# EAGLE schematic Pure SH (EAGLE 8.7.0)
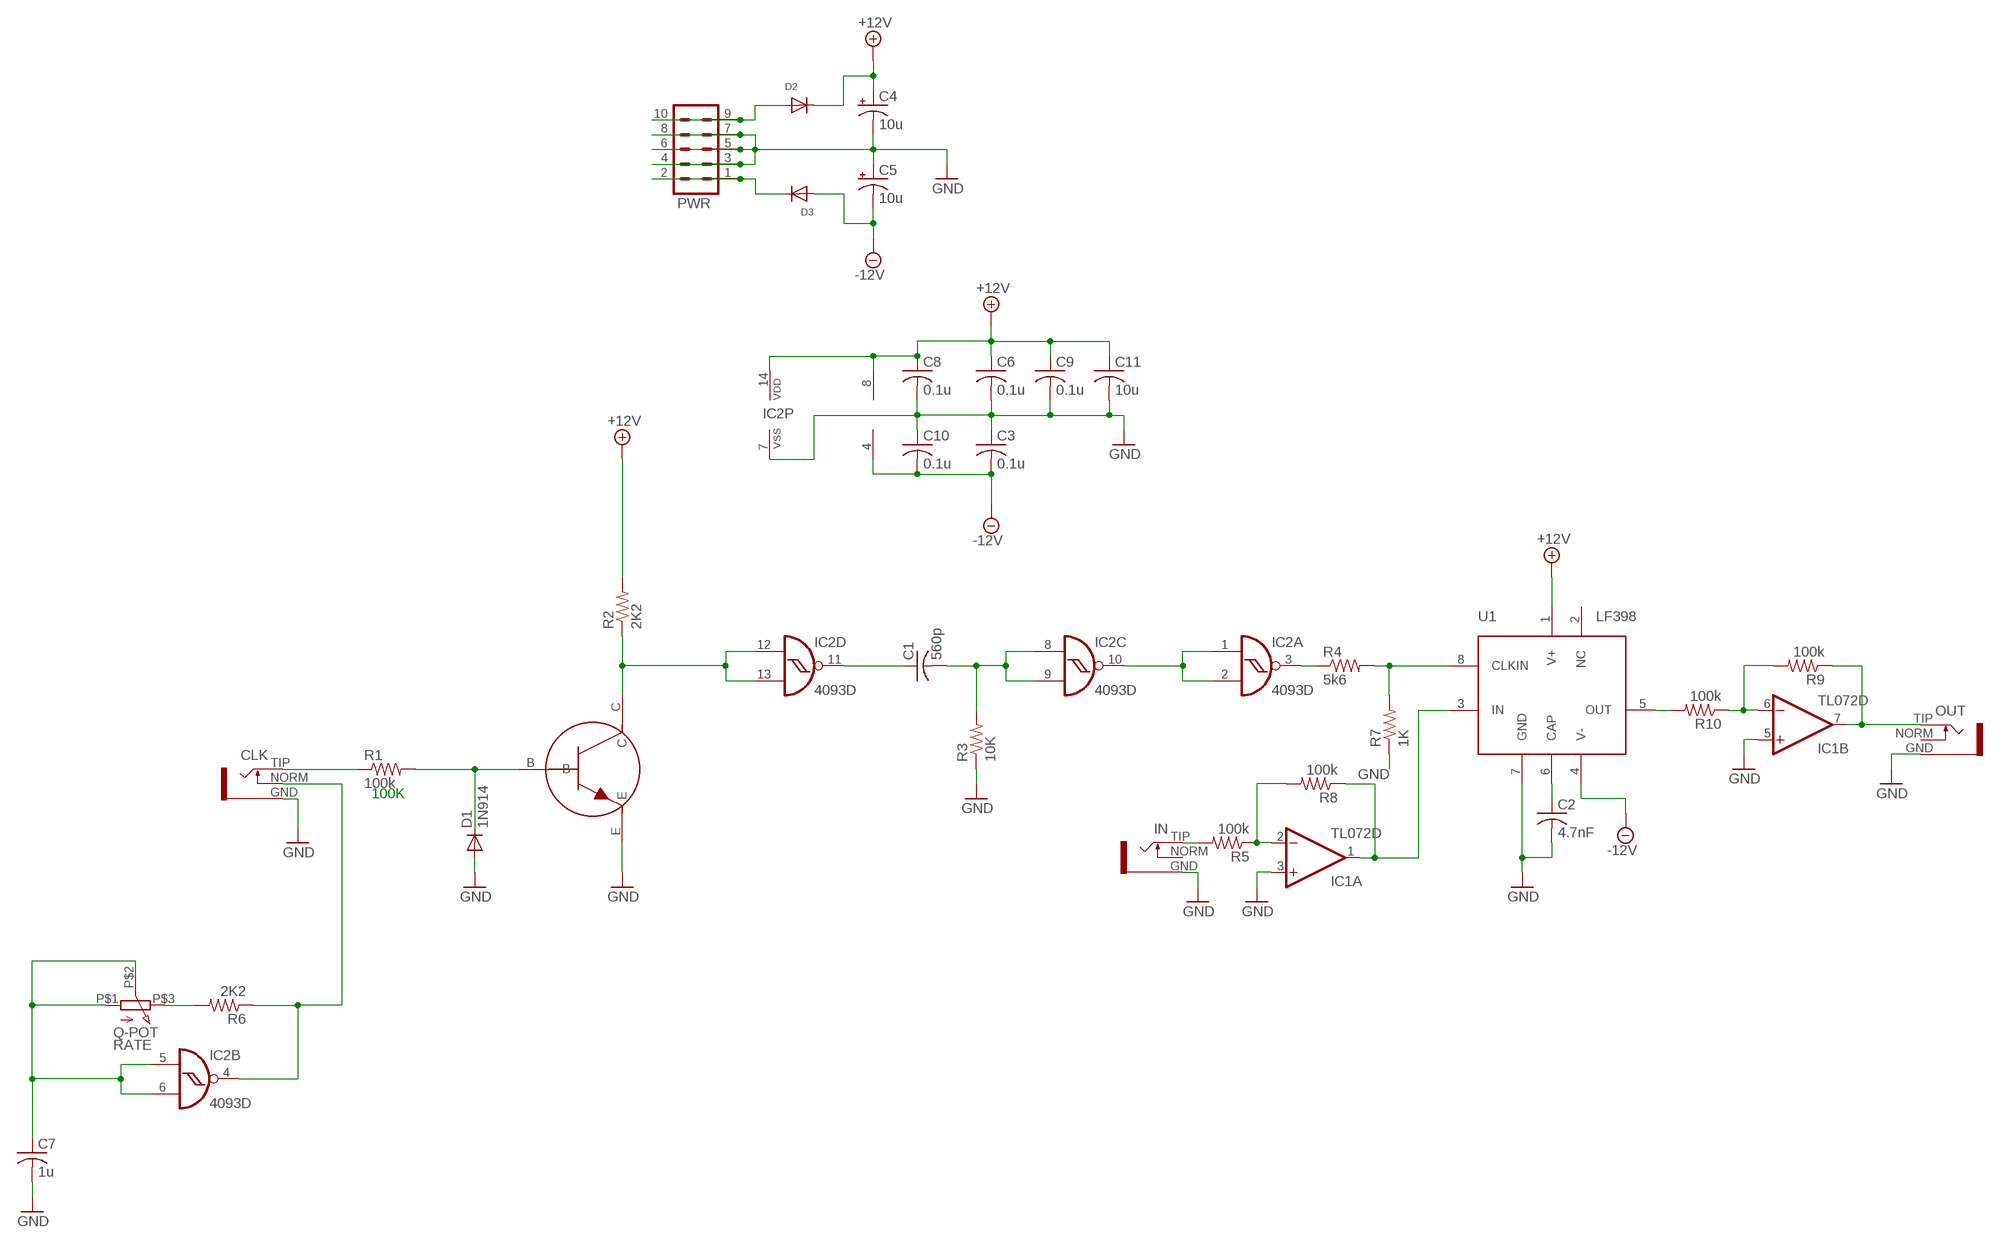
[diagram p0: schematic, sheet 1]

## Parts
C1  560p  C-USC0805K  [C0805K]
C2  4.7nF  C-US050-045X075  [C050-045X075]
C3  0.1u  C-USC0805K  [C0805K]
C4  10u  CPOL-US153CLV-0505  [153CLV-0505]
C5  10u  CPOL-US153CLV-0505  [153CLV-0505]
C6  0.1u  C-USC0805K  [C0805K]
C7  1u  C-USC0805K  [C0805K]
C8  0.1u  C-USC0805K  [C0805K]
C9  0.1u  C-USC0805K  [C0805K]
C10  0.1u  C-USC0805K  [C0805K]
C11  10u  C-USC0805K  [C0805K]
CLK  S_JACK  [S_JACK]
D1  1N914  DIODESOD  [SOD-323]
D2  DIODESMA  [SMADIODE]
D3  DIODESMA  [SMADIODE]
IC1  TL072D  [SO08]
IC2  4093D  [SO14]
IN  S_JACK  [S_JACK]
OUT  S_JACK  [S_JACK]
PWR  M05X2SHD  [2X5-SHROUDED]
R1  100k  R-US_R0805  [R0805]
R2  2K2  R-US_R0805  [R0805]
R3  10K  R-US_R0805  [R0805]
R4  5k6  R-US_R0805  [R0805]
R5  100k  R-US_R0805  [R0805]
R6  2K2  R-US_R0805  [R0805]
R7  1K  R-US_R0805  [R0805]
R8  100k  R-US_R0805  [R0805]
R9  100k  R-US_R0805  [R0805]
R10  100k  R-US_R0805  [R0805]
RATE  Q-POT  [Q-POT]
T1  3904  TRANSISTOR_MMBT3904  [TRANSISTOR_SINGLE_N-TYPE]
U1  LF398  [SOIC--8]

## Nets
+12V: C4.+ C6.1 C8.1 C9.1 C11.1 D2.C IC1.8(P:V+) IC2.14(P:VDD) R2.2 U1.1(V+)
-12V: C3.2 C5.- C10.2 D3.A IC1.4(P:V-) U1.4(V-)
GND: C2.2 C3.1 C4.- C5.+ C6.2 C7.2 C8.2 C9.2 C10.1 C11.2 CLK.GND D1.2(A) IC1.3(A:+IN) IC1.5(B:+IN) IC2.7(P:VSS) IN.GND OUT.GND PWR.3 PWR.4 PWR.5 PWR.6 PWR.7 PWR.8 R3.1 R7.1 T1.E U1.7(GND)
N$1: CLK.TIP R1.1
N$2: D1.1(C) R1.2 T1.B
N$4: IC2.12(D:I0) IC2.13(D:I1) R2.1 T1.C
N$5: C1.1 IC2.11(D:O)
N$6: R4.2 R7.2 U1.8(CLKIN)
N$7: C1.2 IC2.8(C:I0) IC2.9(C:I1) R3.2
N$8: IC2.1(A:I0) IC2.2(A:I1) IC2.10(C:O)
N$9: IC2.3(A:O) R4.1
N$10: C2.1 U1.6(CAP)
N$11: IN.TIP R5.2
N$12: IC1.2(A:-IN) R5.1 R8.2
N$13: R6.2 RATE.P$3
N$14: C7.1 IC2.5(B:I0) IC2.6(B:I1) RATE.P$1 RATE.P$2
N$15: CLK.NORM IC2.4(B:O) R6.1
N$16: IC1.1(A:OUT) R8.1 U1.3(IN)
N$17: R10.2 U1.5(OUT)
N$18: IC1.6(B:-IN) R9.2 R10.1
N$19: IC1.7(B:OUT) OUT.TIP R9.1
N$38: D2.A PWR.9 PWR.10
N$50: D3.C PWR.1 PWR.2
Unconnected: IN.NORM OUT.NORM U1.2(NC)

## Notes on the sheet
- 100K

## Library data of the parts
C1-C3 C6-C11 = rcl:C-US: CAPACITOR, American symbol
C4 C5 = rcl:CPOL-US: POLARIZED CAPACITOR, American symbol
CLK IN OUT = INSTRUO:S_JACK
D1 = SparkFun-DiscreteSemi:DIODE: Diode
D2 D3 = adafruit:DIODE: Diode
IC1 = linear:TL072: OP AMP
IC2 = 40xx:4093: Quad 2-input NAND schmitt trigger
PWR = SparkFun-Connectors:M05X2: Header 5x2 Standard 10-pin dual row 0.1" header. Commonly used with AVR-ISP. Use with Spark Fun Electronics SKU: PRT-00778
R1-R10 = rcl:R-US_: RESISTOR, American symbol
RATE = QuBit:Q-POT
T1 = QuBit:TRANSISTOR_MMBT3904
U1 = QuBit:LF398